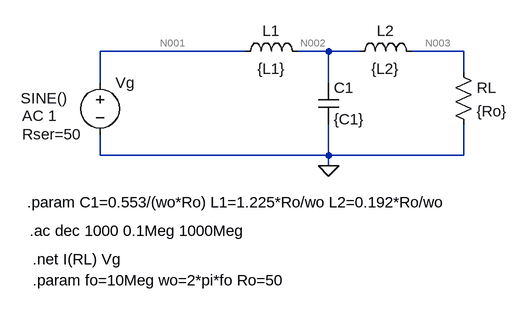
[diagram p0: schematic TS13_desnormalizada.asc]
TS13_desnormalizada.asc, the LTspice schematic file:
Version 4
SHEET 1 1008 680
WIRE 304 112 80 112
WIRE 432 112 384 112
WIRE 480 112 432 112
WIRE 640 112 560 112
WIRE 640 144 640 112
WIRE 80 160 80 112
WIRE 432 160 432 112
WIRE 80 272 80 240
WIRE 432 272 432 224
WIRE 432 272 80 272
WIRE 640 272 640 224
WIRE 640 272 432 272
WIRE 432 288 432 272
FLAG 432 288 0
SYMBOL voltage 80 144 R0
WINDOW 3 -122 40 Left 2
WINDOW 123 -120 67 Left 2
WINDOW 39 -120 95 Left 2
SYMATTR InstName Vg
SYMATTR Value SINE()
SYMATTR Value2 AC 1
SYMATTR SpiceLine Rser=50
SYMBOL ind 288 128 R270
WINDOW 0 32 56 VTop 2
WINDOW 3 5 56 VBottom 2
SYMATTR InstName L1
SYMATTR Value {L1}
SYMBOL ind 464 128 R270
WINDOW 0 32 56 VTop 2
WINDOW 3 5 56 VBottom 2
SYMATTR InstName L2
SYMATTR Value {L2}
SYMBOL cap 416 160 R0
SYMATTR InstName C1
SYMATTR Value {C1}
SYMBOL res 624 128 R0
SYMATTR InstName RL
SYMATTR Value {Ro}
TEXT -32 344 Left 2 !.param C1=0.553/(wo*Ro) L1=1.225*Ro/wo L2=0.192*Ro/wo
TEXT -28 388 Left 2 !.ac dec 1000 0.1Meg 1000Meg
TEXT -24 432 Left 2 !.net I(RL) Vg
TEXT -24 464 Left 2 !.param fo=10Meg wo=2*pi*fo Ro=50

The netlist it stands for:
* TS13_desnormalizada.asc
Vg N001 0 SINE() AC 1 Rser=50
L1 N001 N002 {L1}
L2 N002 N003 {L2}
C1 N002 0 {C1}
RL N003 0 {Ro}
.param C1=0.553/(wo*Ro) L1=1.225*Ro/wo L2=0.192*Ro/wo
.ac dec 1000 0.1Meg 1000Meg
.net I(RL) Vg
.param fo=10Meg wo=2*pi*fo Ro=50
.backanno
.end

* Results of the author's LTspice run, read from the files saved beside the schematic
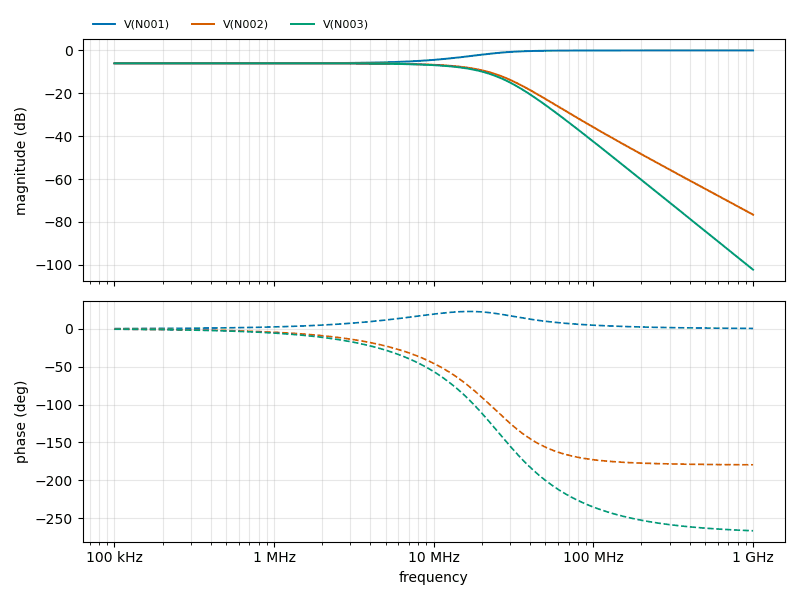
[diagram p1: AC Analysis of TS13_desnormalizada.asc, plotted from the saved traces]
* AC Analysis, 1 run:
*   V(N001): -6.02 dB at 100 kHz, -0.00 dB at 1 GHz, peak -0.00 dB at 1 GHz, 3 dB below the peak at 15.41 MHz
*   V(N002): -6.02 dB at 100 kHz, -76.61 dB at 1 GHz, peak -6.02 dB at 100 kHz, 3 dB below the peak at 19.35 MHz
*   V(N003): -6.02 dB at 100 kHz, -102.29 dB at 1 GHz, peak -6.02 dB at 100 kHz, 3 dB below the peak at 17.91 MHz